# EAGLE design AC-DC (EAGLE 6.4)
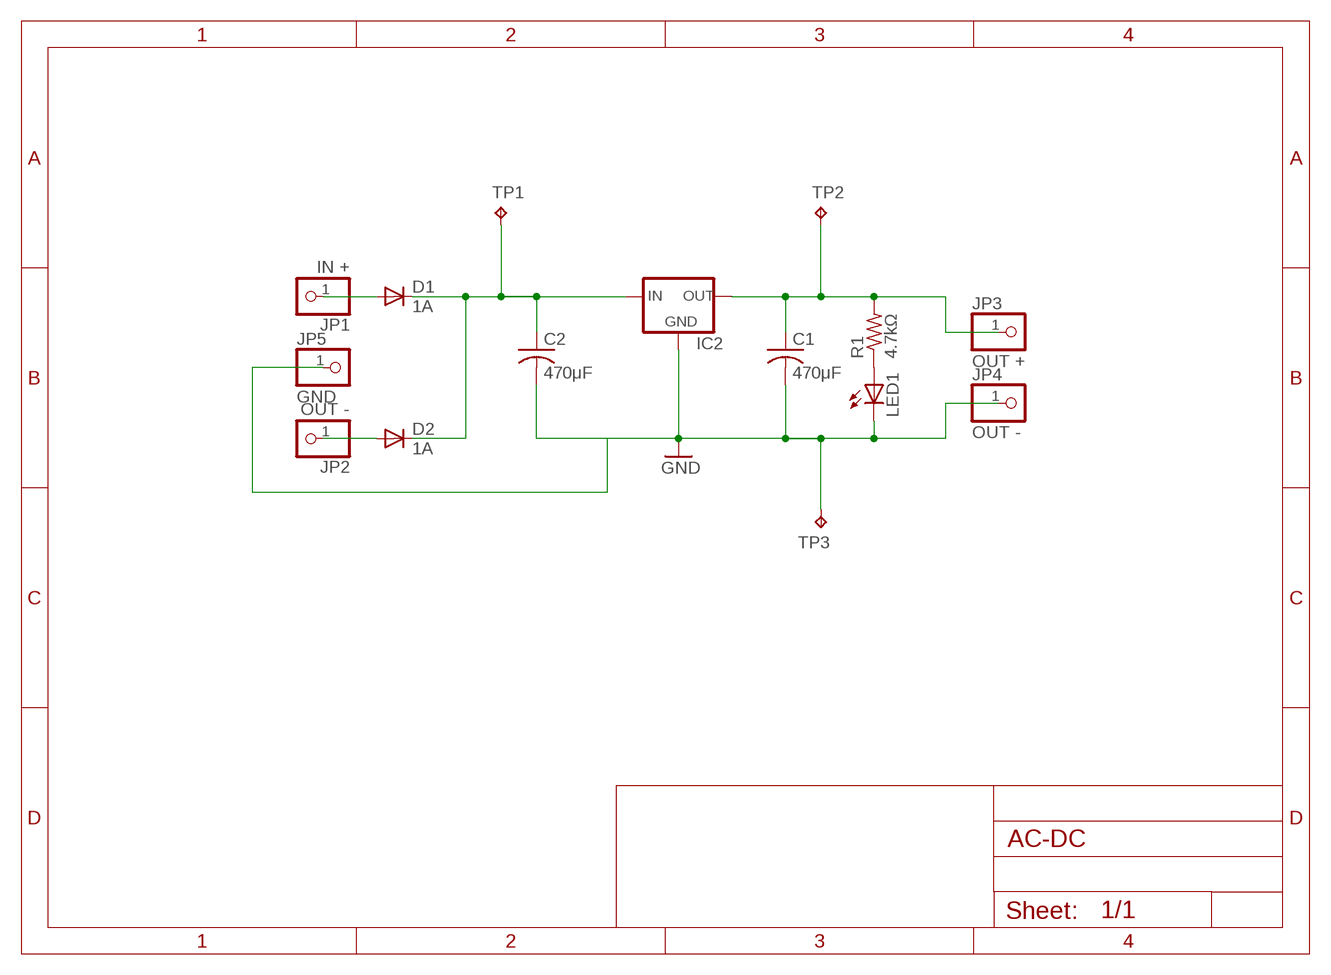
[diagram p0: schematic, sheet 1]

## Parts
C1  470μF  C-US075-032X103  [C075-032X103]
C2  470μF  C-US075-032X103  [C075-032X103]
D1  1A  1N4004  [DO41-10]
D2  1A  1N4004  [DO41-10]
IC2  78XXS  [78XXS]
JP1  IN +  PINHD-1X1  [1X01]
JP2  OUT -  PINHD-1X1  [1X01]
JP3  OUT +  PINHD-1X1  [1X01]
JP4  OUT -  PINHD-1X1  [1X01]
JP5  GND  PINHD-1X1  [1X01]
LED1  LED10MM  [LED10MM]
R1  4.7kΩ  R-US_0207/10  [0207/10]
TP1  TPB1,27  [B1,27]
TP2  TPB1,27  [B1,27]
TP3  TPB1,27  [B1,27]

## Nets
GND: C1.2 C2.2 IC2.GND JP4.1 JP5.1 LED1.K(C) TP3.TP
N$1: C2.1 D1.C D2.C IC2.IN TP1.TP
N$2: C1.1 IC2.OUT JP3.1 R1.2 TP2.TP
N$4: LED1.A R1.1
N$5: D1.A JP1.1
N$6: D2.A JP2.1

## Library data of the parts
C1 C2 = rcl:C-US: CAPACITOR, American symbol
D1 D2 = diode:1N4004: DIODE general purpose rectifier, 1 A
IC2 = v-reg:78XXS: VOLTAGE REGULATOR
JP1-JP5 = pinhead:PINHD-1X1: PIN HEADER
LED1 = led:LED: LED OSRAM: - CHIPLED LG R971, LG N971, LY N971, LG Q971, LY Q971, LO R971, LY R971 LH N974, LH R974 LS Q976, LO Q976, LY Q976 LO Q996 - Hyper CHIPLED LW Q18S LB Q993, LB Q99A, LB R99A - SideLED LS A670, LO A670, LY A670, LG A670, LP A670 LB A673, LV A673, LT A673, LW A673 LH A674 LY A675 LS A676, LA A676, LO A676, LY A676, LW A676 LS A679, LY A679, LG A679 - Hyper Micro SIDELED® LS Y876, LA Y876, LO Y876, LY Y876 LT Y87S - SmartLED LW L88C, LW L88S LB L89C, LB L89S, LG L890 LS L89K, LO L89K, LY L89K LS L896, LA L896, LO L896, LY L896 - TOPLED LS T670, LO T670, LY T670, LG T670, LP T670 LSG T670, LSP T670, LSY T670, LOP T670, LYG T670 LG T671, LOG T671, LSG T671 LB T673, LV T673, LT T673, LW T673 LH T674 LS T676, LA T676, LO T676, LY T676, LB T676, LH T676, LSB T676, LW T676 LB T67C, LV T67C, LT T67C, LS T67K, LO T67K, LY T67K, LW E67C LS E67B, LA E67B, LO E67B, LY E67B, LB E67C, LV E67C, LT E67C LW T67C LS T679, LY T679, LG T679 LS T770, LO T770, LY T770, LG T770, LP T770 LB T773, LV T773, LT T773, LW T773 LH T774 LS E675, LA E675, LY E675, LS T675 LS T776, LA T776, LO T776, LY T776, LB T776 LHGB T686 LT T68C, LB T68C - Hyper Mini TOPLED® LB M676 - Mini TOPLED Santana® LG M470 LS M47K, LO M47K, LY M47K Source: http://www.osram.convergy.de LUXEON: - LUMILED® LXK2-PW12-R00, LXK2-PW12-S00, LXK2-PW14-U00, LXK2-PW14-V00 LXK2-PM12-R00, LXK2-PM12-S00, LXK2-PM14-U00 LXK2-PE12-Q00, LXK2-PE12-R00, LXK2-PE12-S00, LXK2-PE14-T00, LXK2-PE14-U00 LXK2-PB12-K00, LXK2-PB12-L00, LXK2-PB12-M00, LXK2-PB14-N00, LXK2-PB14-P00, LXK2-PB14-Q00 LXK2-PR12-L00, LXK2-PR12-M00, LXK2-PR14-Q00, LXK2-PR14-R00 LXK2-PD12-Q00, LXK2-PD12-R00, LXK2-PD12-S00 LXK2-PH12-R00, LXK2-PH12-S00 LXK2-PL12-P00, LXK2-PL12-Q00, LXK2-PL12-R00 Source: www.luxeon.com KINGBRIGHT: KA-3528ASYC Source: www.kingbright.com
R1 = rcl:R-US_: RESISTOR, American symbol
TP1-TP3 = testpad:TP: Test pad

## Board
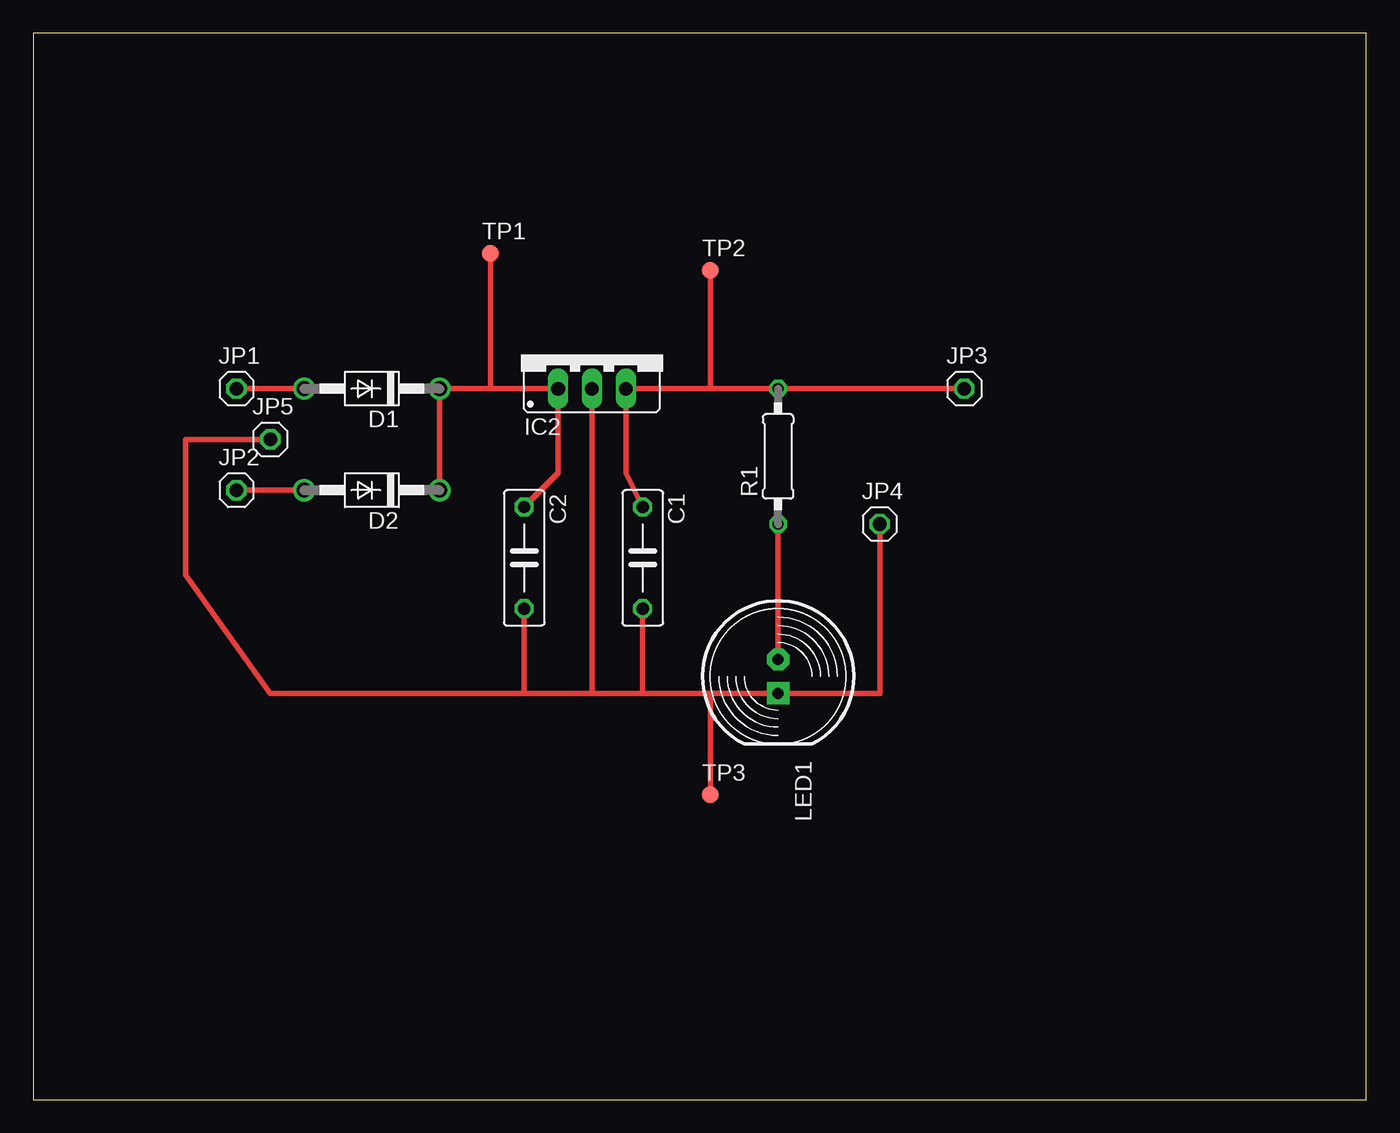
[diagram p1: board, top side]

Size 100 x 80 mm. Coordinates in mm from the lower left corner, seen from the top.
Outline: 0,0 100,0 100,80 0,80 0,0
Copper layers (1*16): Top 0.035mm / dielectric 1.5mm / Bottom 0.035mm
Design rules "default": minimum track width 10mil, minimum drill 24mil, track to track 8mil, track to pad 8mil, pad to pad 8mil, via to via 8mil, smd to smd 8mil, copper to edge 40mil, drill to drill 8mil, minimum pad ring 10mil, minimum via ring 8mil, stop-mask expansion 4mil, vias tented up to drill 0mil, thermal gap 10mil

### Footprints (pad centres in the part's own frame; a part is rotated, then mirrored left to right if it is on the bottom)
C075-032X103 = drill 0.914 octagon: 1 -3.81,0; 2 3.81,0
DO41-10 = drill 1.118: A 5.08,0; C -5.08,0
78XXS = drill 1.016 long: GND 0,-2.54; IN -2.54,-2.54; OUT 2.54,-2.54
1X01 = drill 1.016 octagon: 1 0,0
LED10MM = drill 0.813 pad 1.676 octagon: A -1.27,0 | drill 0.813 pad 1.676 square: K 1.27,0
0207/10 = drill 0.813 octagon: 1 -5.08,0; 2 5.08,0
B1,27 = smd 1.27 x 1.27: TP 0,0

### Placement (x,y rotation side)
C1  45.72,40.64 270 top
C2  36.83,40.64 270 top
D1  25.4,53.34 180 top
D2  25.4,45.72 180 top
IC2  41.91,55.88 0 top
JP1  15.24,53.34 0 top
JP2  15.24,45.72 0 top
JP3  69.85,53.34 0 top
JP4  63.5,43.18 0 top
JP5  17.78,49.53 0 top
LED1  55.88,31.75 270 top
R1  55.88,48.26 90 top
TP1  34.29,63.5 0 top
TP2  50.8,62.23 0 top
TP3  50.8,22.86 0 top

### Tracks (layer width: path | path; a pad name or v marks a point on that pad's centre or on a via)
GND
  Top 0.406: JP4.1 63.5,30.48 LED1.K 50.8,30.48 | JP5.1 11.43,49.53 11.43,39.37 17.78,30.48 36.83,30.48 | 36.83,30.48 41.91,30.48 | 41.91,30.48 45.72,30.48 | 45.72,30.48 50.8,30.48 | C2.2 36.83,30.48 | C1.2 45.72,30.48 | IC2.GND 41.91,30.48 | TP3.TP 50.8,30.48
N$1
  Top 0.406: D2.C D1.C 34.29,53.34 | 34.29,53.34 IC2.IN 39.37,48.26 39.37,46.99 C2.1 | TP1.TP 34.29,62.23 34.29,53.34
N$2
  Top 0.406: C1.1 44.45,46.99 IC2.OUT 50.8,53.34 | TP2.TP 50.8,53.34 | R1.2 50.8,53.34 | 50.8,53.34 R1.2 | R1.2 JP3.1
N$4
  Top 0.406: R1.1 LED1.A
N$5
  Top 0.406: JP1.1 D1.A
N$6
  Top 0.406: JP2.1 D2.A